# Altium schematic sheet Flight_controller v1.0.SchDoc
size A4; SheetNumber: 1; SheetTotal: 5
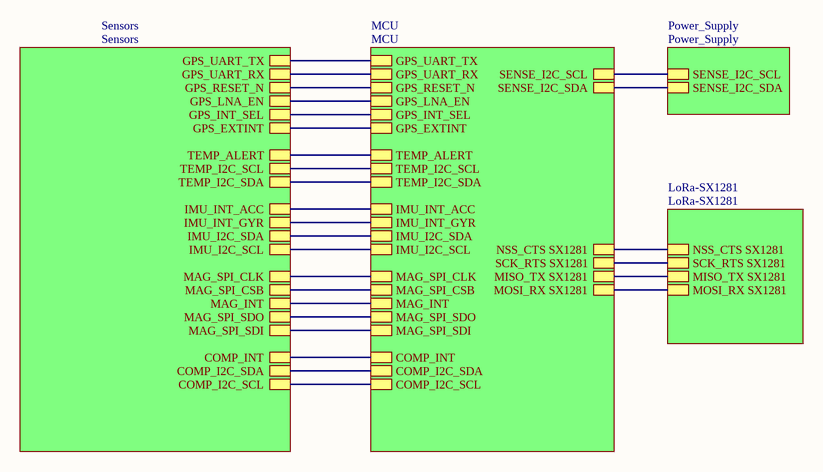
[diagram p0: Flight_controller v1.0.SchDoc]

## Sub-sheets
LoRa-SX1281 = LoRa-SX1281: NSS_CTS SX1281, SCK_RTS SX1281, MISO_TX SX1281, MOSI_RX SX1281
MCU = MCU: GPS_INT_SEL, GPS_UART_RX, GPS_EXTINT, SENSE_I2C_SDA, TEMP_ALERT, GPS_LNA_EN, GPS_RESET_N, TEMP_I2C_SCL, GPS_UART_TX, TEMP_I2C_SDA, IMU_INT_GYR, IMU_I2C_SDA, IMU_I2C_SCL, IMU_INT_ACC, SENSE_I2C_SCL, MAG_SPI_SDO, MAG_SPI_CSB, MAG_INT, MAG_SPI_CLK, MAG_SPI_SDI, COMP_I2C_SCL, COMP_INT, COMP_I2C_SDA, NSS_CTS SX1281, MISO_TX SX1281, MOSI_RX SX1281, SCK_RTS SX1281
Power_Supply = Power_Supply: SENSE_I2C_SDA, SENSE_I2C_SCL
Sensors = Sensors: GPS_UART_TX, GPS_RESET_N, GPS_UART_RX, GPS_LNA_EN, GPS_INT_SEL, GPS_EXTINT, TEMP_ALERT, TEMP_I2C_SCL, TEMP_I2C_SDA, IMU_I2C_SDA, IMU_I2C_SCL, IMU_INT_ACC, IMU_INT_GYR, MAG_SPI_CLK, MAG_SPI_CSB, MAG_SPI_SDO, MAG_INT, MAG_SPI_SDI, COMP_INT, COMP_I2C_SDA, COMP_I2C_SCL

## Nets
(unnamed): sheet MCU/GPS_INT_SEL, sheet Sensors/GPS_INT_SEL
(unnamed): sheet MCU/GPS_UART_RX, sheet Sensors/GPS_UART_RX
(unnamed): sheet MCU/GPS_EXTINT, sheet Sensors/GPS_EXTINT
(unnamed): sheet MCU/SENSE_I2C_SDA, sheet Power_Supply/SENSE_I2C_SDA
(unnamed): sheet MCU/TEMP_ALERT, sheet Sensors/TEMP_ALERT
(unnamed): sheet MCU/GPS_LNA_EN, sheet Sensors/GPS_LNA_EN
(unnamed): sheet MCU/GPS_RESET_N, sheet Sensors/GPS_RESET_N
(unnamed): sheet MCU/TEMP_I2C_SCL, sheet Sensors/TEMP_I2C_SCL
(unnamed): sheet MCU/GPS_UART_TX, sheet Sensors/GPS_UART_TX
(unnamed): sheet MCU/TEMP_I2C_SDA, sheet Sensors/TEMP_I2C_SDA
(unnamed): sheet MCU/IMU_INT_GYR, sheet Sensors/IMU_INT_GYR
(unnamed): sheet MCU/IMU_I2C_SDA, sheet Sensors/IMU_I2C_SDA
(unnamed): sheet MCU/IMU_I2C_SCL, sheet Sensors/IMU_I2C_SCL
(unnamed): sheet MCU/IMU_INT_ACC, sheet Sensors/IMU_INT_ACC
(unnamed): sheet MCU/SENSE_I2C_SCL, sheet Power_Supply/SENSE_I2C_SCL
(unnamed): sheet MCU/MAG_SPI_SDO, sheet Sensors/MAG_SPI_SDO
(unnamed): sheet MCU/MAG_SPI_CSB, sheet Sensors/MAG_SPI_CSB
(unnamed): sheet MCU/MAG_INT, sheet Sensors/MAG_INT
(unnamed): sheet MCU/MAG_SPI_CLK, sheet Sensors/MAG_SPI_CLK
(unnamed): sheet MCU/MAG_SPI_SDI, sheet Sensors/MAG_SPI_SDI
(unnamed): sheet MCU/COMP_I2C_SCL, sheet Sensors/COMP_I2C_SCL
(unnamed): sheet MCU/COMP_INT, sheet Sensors/COMP_INT
(unnamed): sheet MCU/COMP_I2C_SDA, sheet Sensors/COMP_I2C_SDA
(unnamed): sheet MCU/NSS_CTS SX1281, sheet LoRa-SX1281/NSS_CTS SX1281
(unnamed): sheet MCU/MISO_TX SX1281, sheet LoRa-SX1281/MISO_TX SX1281
(unnamed): sheet MCU/MOSI_RX SX1281, sheet LoRa-SX1281/MOSI_RX SX1281
(unnamed): sheet MCU/SCK_RTS SX1281, sheet LoRa-SX1281/SCK_RTS SX1281